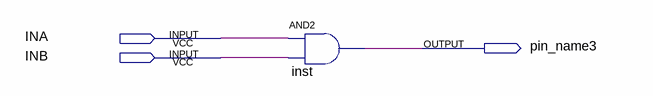
[diagram p0: schematic sheet]
// Quartus schematic CPLD001.bdf as structural Verilog: 1 symbols, 3 pins
module CPLD001 (
  input  INA,
  input  INB,
  output pin_name3
);

  and inst (pin_name3, INA, INB);
endmodule
